# EAGLE schematic breakout (EAGLE 7.2.0)
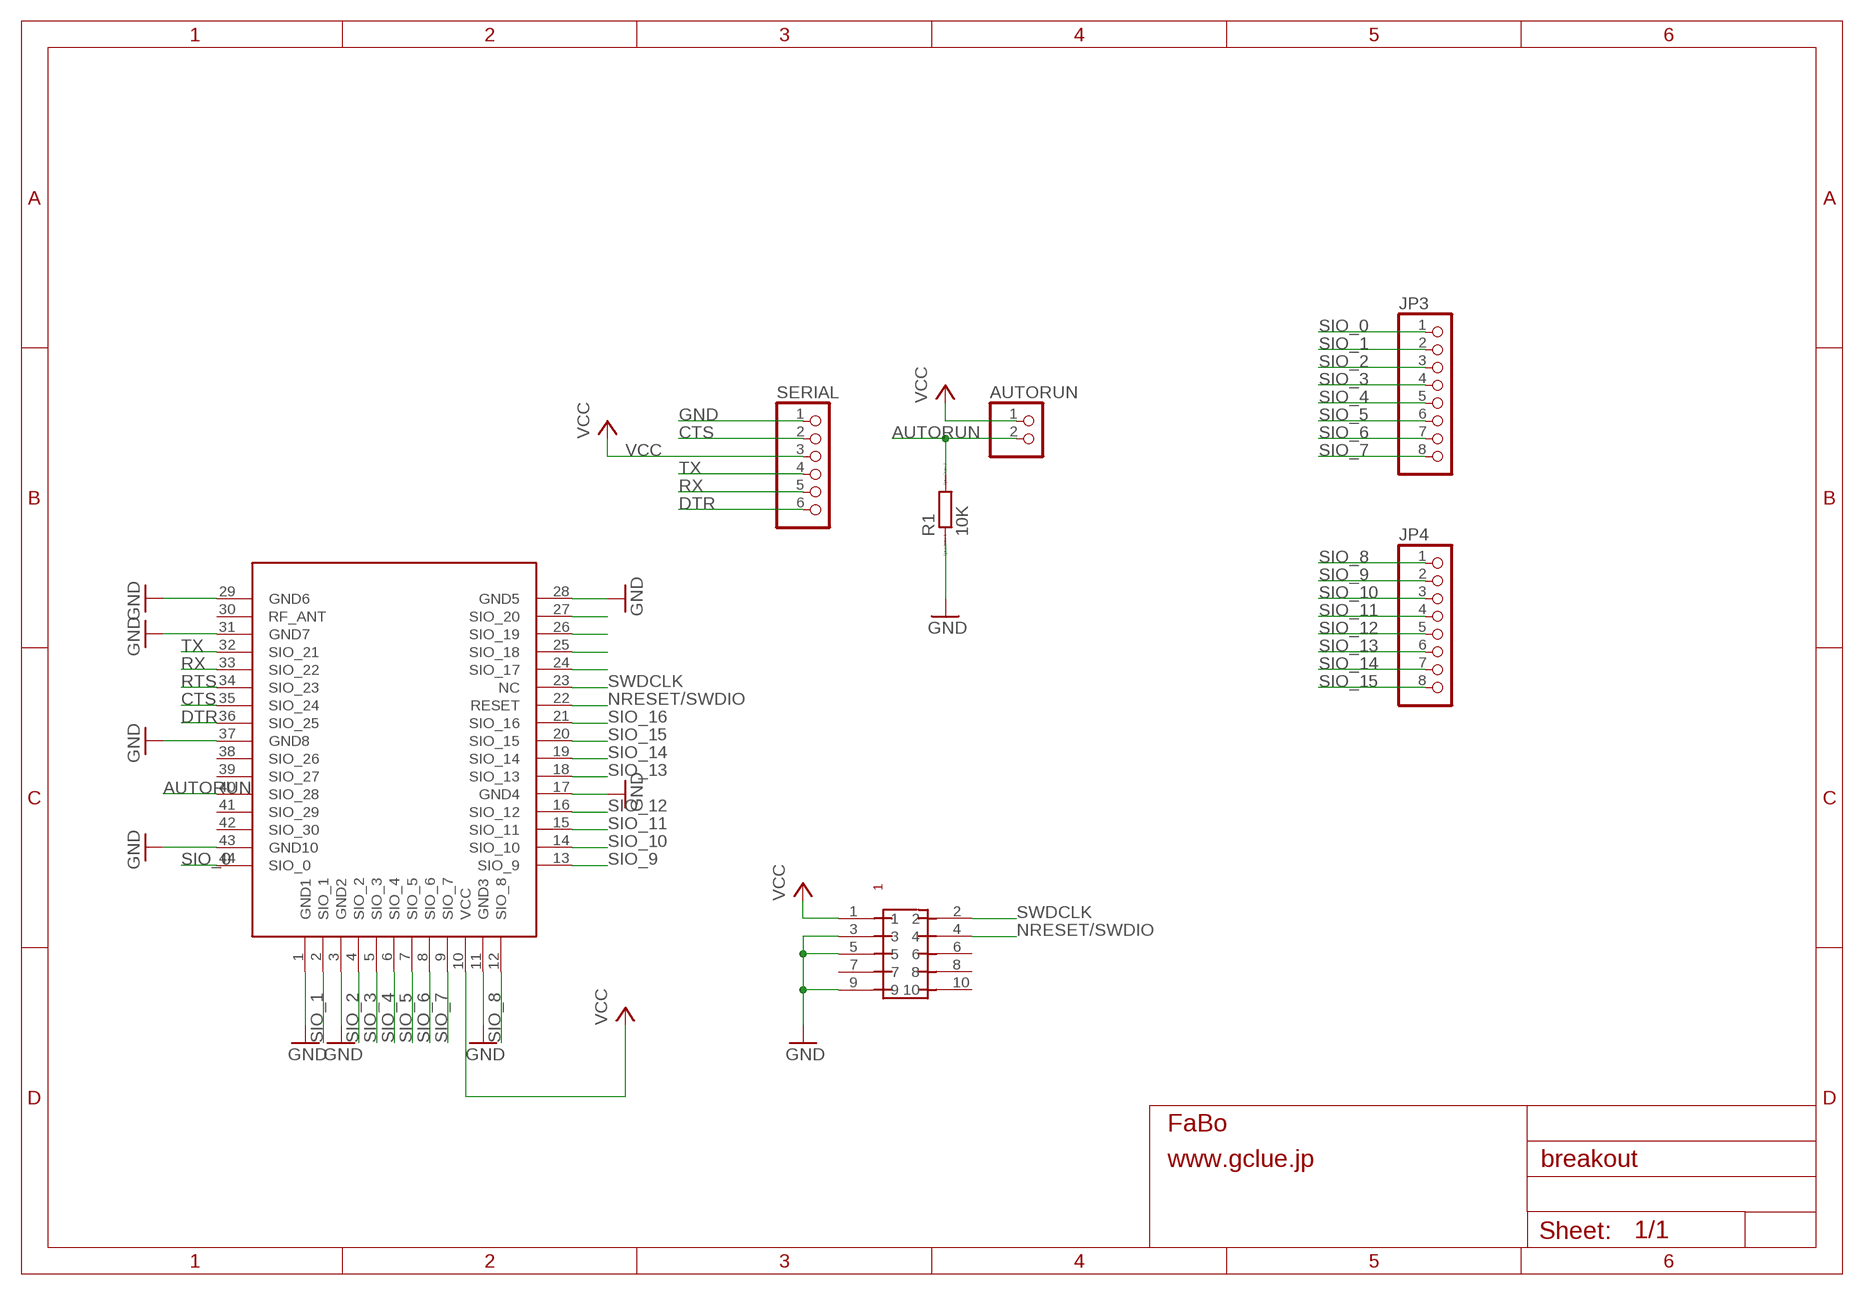
[diagram p0: schematic, sheet 1]

## Parts
AUTORUN  PINHD-1X2  [1X02]
BL1  LAIRD-BL600  [LAIRD-BL600]
JP3  PINHD-1X8-3.5MM  [1X08-3.5MM]
JP4  PINHD-1X8-3.5MM  [1X08-3.5MM]
R1  10K  RR0603  [R0603]
SERIAL  PINHD-1X6  [1X06]
U$1  PIN-HEADER-SMT(1.27MM)2X5  [PIN-HEADER-SMT(1.27MM)2X5]

## Nets
AUTORUN: AUTORUN.2 BL1.40(SIO_28) R1.2
CTS: BL1.35(SIO_24) SERIAL.2
DTR: BL1.36(SIO_25) SERIAL.6
GND: BL1.1(GND1) BL1.3(GND2) BL1.11(GND3) BL1.17(GND4) BL1.28(GND5) BL1.29(GND6) BL1.31(GND7) BL1.37(GND8) BL1.43(GND10) R1.1 SERIAL.1 U$1.3 U$1.5 U$1.9
N$9: BL1.24(SIO_17)
N$10: BL1.25(SIO_18)
N$11: BL1.26(SIO_19)
N$12: BL1.27(SIO_20)
NRESET/SWDIO: BL1.22(RESET) U$1.4
RTS: BL1.34(SIO_23)
RX: BL1.33(SIO_22) SERIAL.5
SIO_0: BL1.44(SIO_0) JP3.1
SIO_1: BL1.2(SIO_1) JP3.2
SIO_2: BL1.4(SIO_2) JP3.3
SIO_3: BL1.5(SIO_3) JP3.4
SIO_4: BL1.6(SIO_4) JP3.5
SIO_5: BL1.7(SIO_5) JP3.6
SIO_6: BL1.8(SIO_6) JP3.7
SIO_7: BL1.9(SIO_7) JP3.8
SIO_8: BL1.12(SIO_8) JP4.1
SIO_9: BL1.13(SIO_9) JP4.2
SIO_10: BL1.14(SIO_10) JP4.3
SIO_11: BL1.15(SIO_11) JP4.4
SIO_12: BL1.16(SIO_12) JP4.5
SIO_13: BL1.18(SIO_13) JP4.6
SIO_14: BL1.19(SIO_14) JP4.7
SIO_15: BL1.20(SIO_15) JP4.8
SIO_16: BL1.21(SIO_16)
SWDCLK: BL1.23(NC) U$1.2
TX: BL1.32(SIO_21) SERIAL.4
VCC: AUTORUN.1 BL1.10(VCC) SERIAL.3 U$1.1
Unconnected: BL1.30(RF_ANT) BL1.38(SIO_26) BL1.39(SIO_27) BL1.41(SIO_29) BL1.42(SIO_30) U$1.6 U$1.7 U$1.8 U$1.10

## Library data of the parts
AUTORUN = pinhead:PINHD-1X2: PIN HEADER
BL1 = gclueBT:LAIRD-BL600: Laird BL600 Bluetooth Bluetooth 4.0 low energy radio Radio Transmit power: +4 dBm Receiver sensitivity: -91 dBm Typical line-of-sight range: Current Consumption System Idle: 3.5uA Transmit: 10.5mA@0dBm Certifications Japan: MIC Japan BL600-SA 204-320049 Ceramic BL600-SC 204-320050 IPEX MHF4 BL600-ST 204-320048 Trace Pad Reference Hardware Integration Guide <http://www.lairdtech.com/brandworld/library/BL600%20Hardware%20Integration%20Guide.pdf>
JP3 JP4 = adafruit:PINHD-1X8: PIN HEADER
R1 = eagle-ltspice:R: RESISTOR, European symbol; SPICEMODEL: NONE; SPICEPREFIX: R
SERIAL = adafruit:PINHD-1X6: PIN HEADER
U$1 = gclue:PIN-HEADER-SMT(1.27MM)2X5: PIN-HEADER-SMT (1.27MM) 2x5